# EAGLE schematic Secondary Board Schematic v3 (EAGLE 9.7.0)
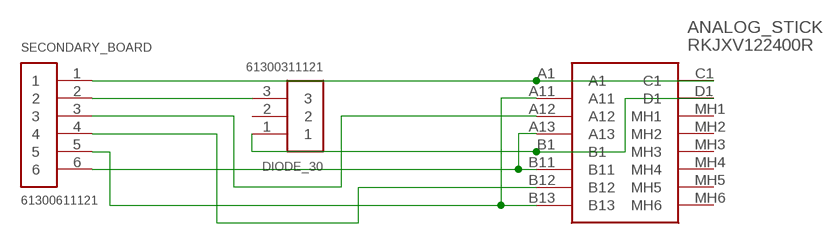
[diagram p0: schematic, sheet 1]

## Parts
ANALOG_STICK  RKJXV122400R  [RKJXV122400R]
DIODE_30  61300311121  [61300311121]
SECONDARY_BOARD  61300611121  [61300611121]

## Nets
N$1: DIODE_30.3 SECONDARY_BOARD.2
N$2: ANALOG_STICK.A1 ANALOG_STICK.C1 SECONDARY_BOARD.1
N$3: ANALOG_STICK.B1 ANALOG_STICK.D1 DIODE_30.1
N$4: ANALOG_STICK.A13 ANALOG_STICK.B11 SECONDARY_BOARD.6
N$5: ANALOG_STICK.A11 ANALOG_STICK.B13 SECONDARY_BOARD.5
N$6: ANALOG_STICK.A12 SECONDARY_BOARD.3
N$7: ANALOG_STICK.B12 SECONDARY_BOARD.4
Unconnected: ANALOG_STICK.MH1 ANALOG_STICK.MH2 ANALOG_STICK.MH3 ANALOG_STICK.MH4 ANALOG_STICK.MH5 ANALOG_STICK.MH6 DIODE_30.2

## Library data of the parts
ANALOG_STICK = SamacSys_Parts:RKJXV122400R: RKJXV122400R Source: Datasheet <https://tech.alpsalpine.com/prod/e/html/multicontrol/potentiometer/rkjxk/rkjxv122400r.html>; DESCRIPTION: RKJXV122400R; HEIGHT: 18.95mm; MANUFACTURER_NAME: ALPS; MANUFACTURER_PART_NUMBER: RKJXV122400R; MOUSER_PART_NUMBER: 688-RKJXV122400R; MOUSER_PRICE-STOCK: https://www.mouser.co.uk/ProductDetail/ALPS/RKJXV122400R?qs=GedFDFLaBXEbB%252ByoOVwLBg%3D%3D
DIODE_30 = Headers:61300311121: CONN HEADER VERT 3POS 2.54MM Manufacturer's datasheet <https://katalog.we-online.de/em/datasheet/6130xx11121.pdf>; CREATED_BY: PCBLayout.com; DIGI_KEY_PART_NUMBER: 732-5316-ND; MANUFACTURER: Wurth Electronics Inc.; MPN: 61300311121
SECONDARY_BOARD = Headers:61300611121: CONN HEADER VERT 6POS 2.54MM Manufacturer's datasheet <https://katalog.we-online.de/em/datasheet/6130xx11121.pdf>; CREATED_BY: PCBLayout.com; DIGI_KEY_PART_NUMBER: 732-5319-ND; MANUFACTURER: Wurth Electronics Inc.; MPN: 61300611121